# Altium schematic sheet WC_LCD.SchDoc
size A; Organization: Altium Limited; Address1: L3, 12a Rodborough Rd; Address2: Frenchs Forest; Address3: NSW; Address4: Australia 2086; DocumentNumber: 2; SheetNumber: 2; SheetTotal: 11
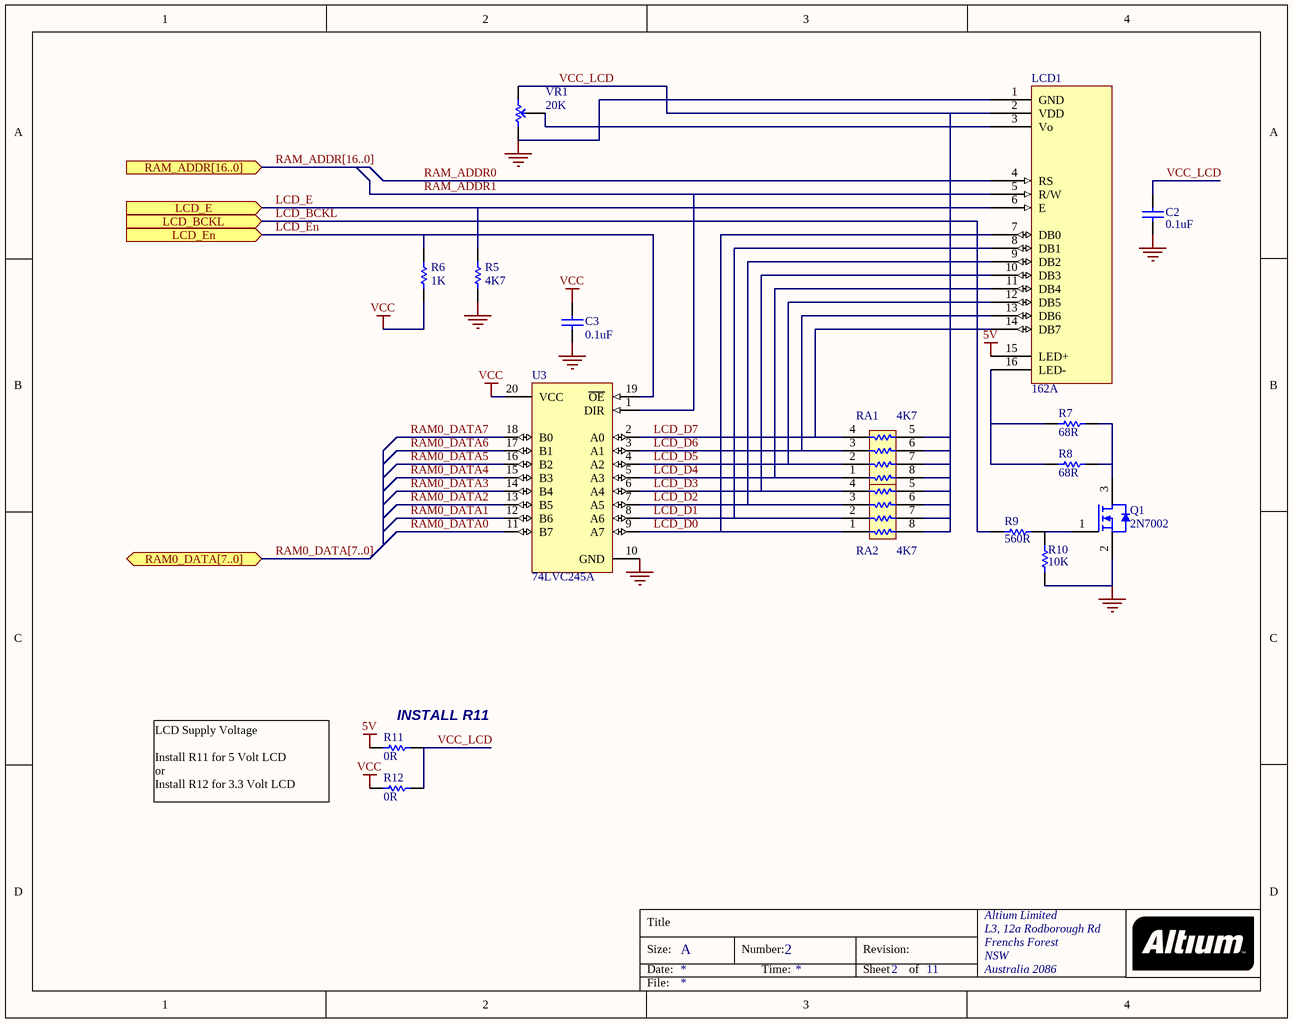
[diagram p0: WC_LCD.SchDoc]

## Parts
C2  0.1uF  [CC2012-0805]
C3  0.1uF  [CC2012-0805]
LCD1  162A  [162A]
Q1  2N7002  [SO-G3]
R5  4K7  [CC2012-0805]
R6  1K  [CC2012-0805]
R7  68R  [CC2012-0805]
R8  68R  [CC2012-0805]
R9  560R  [CC2012-0805]
R10  10K  [CC2012-0805]
R11  0R  [CC2012-0805]
R12  0R  [CC2012-0805]
RA1  4K7  [MNR34]
RA2  4K7  [MNR34]
U3  74LVC245A  [SSO-G20/P.65]
VR1  20K  [POT4MM-2]

## Ports
LCD_BCKL (in), LCD_E (in), LCD_En (in), RAM0_DATA[7..0] (bidir), RAM_ADDR[16..0] (in)

## Nets
5V: LCD1.15(LED+) R11.1
GND: C2.2 C3.2 LCD1.1(GND) Q1.2 R5.2 R10.1 U3.10(GND) VR1.CCW(-)
VCC: C3.1 R6.2 R12.1 U3.20(VCC)
LCD_BCKL: R9.1 ; port LCD_BCKL
LCD_D0: LCD1.7(DB0) RA2.1 U3.9(A7)
LCD_D1: LCD1.8(DB1) RA2.2 U3.8(A6)
LCD_D2: LCD1.9(DB2) RA2.3 U3.7(A5)
LCD_D3: LCD1.10(DB3) RA2.4 U3.6(A4)
LCD_D4: LCD1.11(DB4) RA1.1 U3.5(A3)
LCD_D5: LCD1.12(DB5) RA1.2 U3.4(A2)
LCD_D6: LCD1.13(DB6) RA1.3 U3.3(A1)
LCD_D7: LCD1.14(DB7) RA1.4 U3.2(A0)
LCD_E: LCD1.6(E) R5.1 ; port LCD_E
LCD_En: R6.1 U3.19(~{OE}) ; port LCD_En
RAM0_DATA0: U3.11(B7)
RAM0_DATA1: U3.12(B6)
RAM0_DATA2: U3.13(B5)
RAM0_DATA3: U3.14(B4)
RAM0_DATA4: U3.15(B3)
RAM0_DATA5: U3.16(B2)
RAM0_DATA6: U3.17(B1)
RAM0_DATA7: U3.18(B0)
RAM_ADDR0: LCD1.4(RS)
RAM_ADDR1: LCD1.5(R/W) U3.1(DIR)
VCC_LCD: C2.1 LCD1.2(VDD) R11.2 R12.2 RA1.5 RA1.6 RA1.7 RA1.8 RA2.5 RA2.6 RA2.7 RA2.8 VR1.CW(+)
NetLCD1_3: LCD1.3(Vo) VR1.W
NetLCD1_16: LCD1.16(LED-) R7.1 R8.1
NetQ1_1: Q1.1 R9.2 R10.2
NetQ1_3: Q1.3 R7.2 R8.2

## Buses and harness runs
bus RAM0_DATA[7..0] = port RAM0_DATA[7..0]
bus RAM_ADDR[16..0] = port RAM_ADDR[16..0]

## Notes on the sheet
- (near R11) INSTALL R11
- LCD Supply Voltage
  Install R11 for 5 Volt LCD
  or
  Install R12 for 3.3 Volt LCD
- Title
- Size:
- Date:
- A
- Number:
- Time:
- Revision:
- Sheet
- of
- File:

## Library data of the parts
C2 C3 = CAP: Capacitor
LCD1 = 162A: 16 char * 2 line LCD character display with b/light
Q1 = 2N7002: N Channel Mosfet
R5-R12 = RES: Resistor
RA1 RA2 = MNR34: 3216x4 Resistor Array
U3 = 74LVC245A: Octal Bus Transceiver with 3-State Outputs; Manufacturer: Texas Instruments; Revision 1: 12-July-2000: SIM Model Added.; Revision 2: July-2002: Re-released for DXP Platform.; Class I: Interface; Class II: Line Transceiver; Published: 8-Jun-2000; Datasheet: Latest Revision: Oct-1993; Package Reference: J020; Publisher: Altium Limited
VR1 = POT_M: Potentiometer